# Altium schematic sheet CAN-FD.SchDoc
size A; Engineer: Will Snyder; Revision: 1.0; SheetNumber: 1; SheetTotal: 5; DocumentTitle: CAN-FD
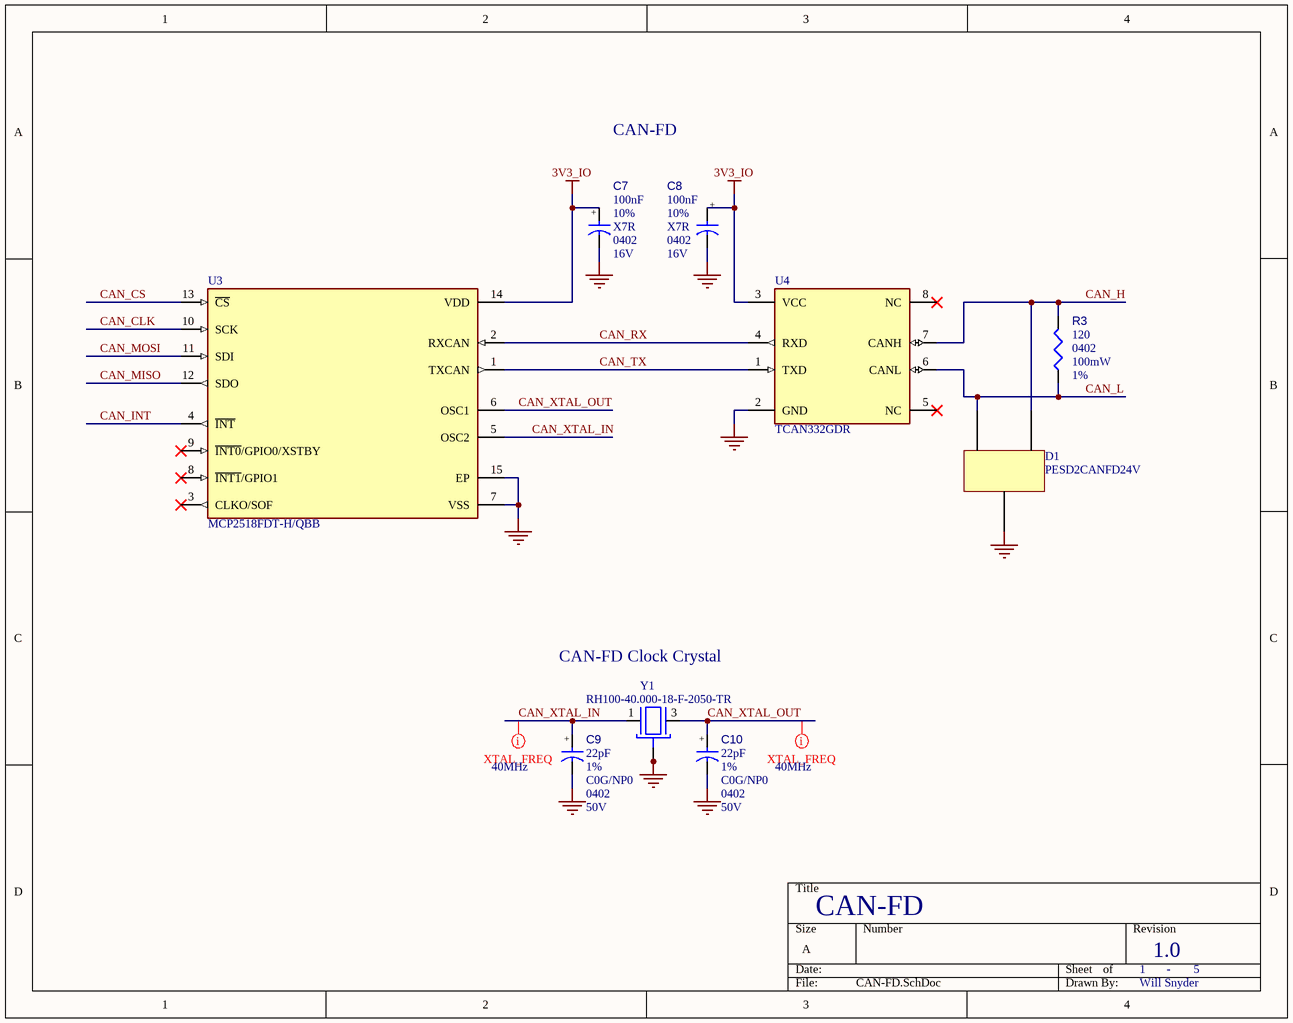
[diagram p0: CAN-FD.SchDoc]

## Parts
C7  value 100nF  Tolerance: 10%  Capacitor Type: X7R  Case/Package: 0402  Voltage Rating: 16V  [CAPC1005X56X25LL10T15]  (hidden comment: Capacitor 0.1 uF +/- 5% 16 V 0402)
C8  value 100nF  Tolerance: 10%  Capacitor Type: X7R  Case/Package: 0402  Voltage Rating: 16V  [CAPC1005X56X25LL10T15]  (hidden comment: Capacitor 0.1 uF +/- 5% 16 V 0402)
C9  value 22pF  Tolerance: 1%  Capacitor Type: C0G/NP0  Case/Package: 0402  Voltage Rating: 50V  [CAPC1005X56X25LL10T15]  (hidden comment: Capacitor 0.1 uF +/- 5% 16 V 0402)
C10  value 22pF  Tolerance: 1%  Capacitor Type: C0G/NP0  Case/Package: 0402  Voltage Rating: 50V  [CAPC1005X56X25LL10T15]  (hidden comment: Capacitor 0.1 uF +/- 5% 16 V 0402)
D1  PESD2CANFD24V  [SOT95P230X110-3N]
R3  value 120  Case/Package: 0402  Power: 100mW  Tolerance: 1%  [FP-ERJ2RK-IPC_B]  (hidden comment: ERJ-2RKF3002X)
U3  MCP2518FDT-H/QBB  [FP-C04-21361-IPC_A]
U4  TCAN332GDR  [Copy of SOIC127P599X175-8N]
Y1  RH100-40.000-18-F-2050-TR  [XTAL_RH100-40.000-18-F-2050-TR]

## Nets
3V3_IO: C7.1 C8.1 U3.14(VDD) U4.3(VCC)
GND: C7.2 C8.2 C9.2 C10.2 D1.3(CC) U3.7(VSS) U3.15(EP) U4.2(GND) Y1.2(GND) Y1.4(GND)
CAN_CLK: U3.10(SCK)
CAN_CS: U3.13(~{CS})
CAN_H: D1.1(K1) R3.1 U4.7(CANH)
CAN_INT: U3.4(~{INT})
CAN_L: D1.2(K2) R3.2 U4.6(CANL)
CAN_MISO: U3.12(SDO)
CAN_MOSI: U3.11(SDI)
CAN_RX: U3.2(RXCAN) U4.4(RXD)
CAN_TX: U3.1(TXCAN) U4.1(TXD)
CAN_XTAL_IN: C9.1 U3.5(OSC2) Y1.1
CAN_XTAL_OUT: C10.1 U3.6(OSC1) Y1.3

Not connected (* = marked no-connect by the designer): U3 3(CLKO/SOF)* 8(~{INT1}/GPIO1)* 9(~{INT0}/GPIO0/XSTBY)*; U4 5(NC)* 8(NC)*

## Layout directives
Frequency: 40MHz: CAN_XTAL_IN, CAN_XTAL_OUT

## Notes on the sheet
- CAN-FD
- CAN-FD Clock Crystal
- -
- (in symbol CMP-001-00001-9) +

## Library data of the parts
C7-C10 = CMP-001-00001-9: Chip Capacitor, 0.1 uF, +/- 5%, 16 V, 0402 (1005 Metric); Mounting Technology: SM; RoHS Compliant: True; Max Operating Temperature: 125°C; Pins: 2; Min Operating Temperature: -55°C
D1 = CMP-004-00043-1: Trans Voltage Suppressor Diode, 24V V(RWM), Bidirectional, 2 Element, Silicon, TO-236AB; RoHS Compliant: Yes
R3 = CMP-009-00190-1: Fixed Resistor, Metal Glaze/thick Film, 0.1W, 30000ohm, 50V, 1% +/-Tol, 100ppm/Cel, Surface Mount, 0402; Min Operating Temperature: -55°C; RoHS Compliant: Yes; Pins: 2; Max Operating Temperature: 155°C; Mounting Technology: Surface Mount
U3 = CMP-015-00016-2: 1 Channel(s), 8MBps, CMOS, PDCC14; RoHS Compliant: Yes
U4 = CMP-015-00013-7: Interface Circuit, PDSO8; Nominal Supply Voltage: 3.3V; Min Operating Temperature: -40°C; Pins: 8; Case/Package: SOP; Max Operating Temperature: 125°C; RoHS Compliant: Yes
Y1 = CMP-003-00030-2: 40 MHz Â±20ppm Crystal 18pF 50 Ohms 4-SMD, No Lead; MF: Raltron Electronics; Pins: 4; SnapEDA_Link: https://www.snapeda.com/parts/RH100-40.000-18-F-2050-TR/Raltron+Electronics/view-part/?ref=snap; Check_prices: https://www.snapeda.com/parts/RH100-40.000-18-F-2050-TR/Raltron+Electronics/view-part/?ref=eda; Case/Package: None; Source: RH100-40.000-18-F-2050-TR.SchLib; Component Type: Standard; Design Item ID: RH100-40.000-18-F-2050-TR; Value: *; MP: RH100-40.000-18-F-2050-TR